# Altium schematic sheet vending_machine_V1.1.SchDoc
size A4; SheetNumber: 1; SheetTotal: 1
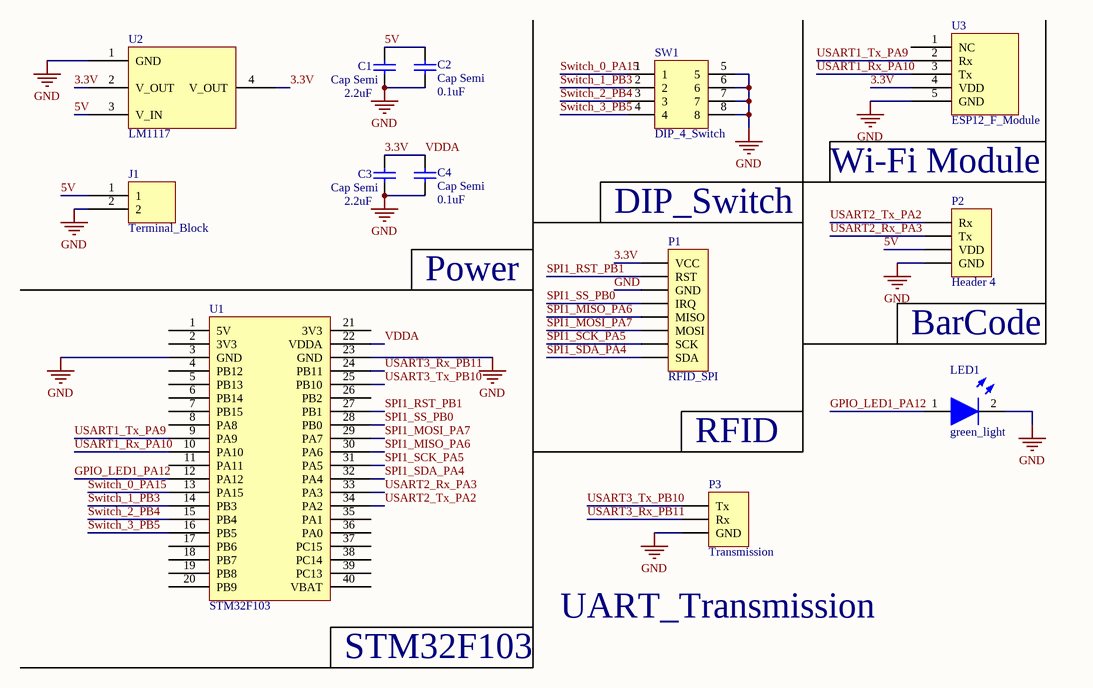
[diagram p0: vending_machine_V1.1.SchDoc]

## Parts
C1  Cap Semi  value 2.2uF  [1608[0603]]
C2  Cap Semi  value 0.1uF  [1608[0603]]
C3  Cap Semi  value 2.2uF  [1608[0603]]
C4  Cap Semi  value 0.1uF  [1608[0603]]
J1  Terminal_Block  [terminal block]
LED1  green_light  [LED_Green]
P1  RFID_SPI  [HDR1X8]
P2  Header 4  [HDR1X4]
P3  Transmission  [HDR1X3]
SW1  DIP_4_Switch  [Switch_4]
U1  STM32F103  [STM32F103]
U2  LM1117  [LM1117 - duplicate]
U3  ESP12_F_Module  [ESP12_F_Holtek]

## Nets
GND: C1.1 C2.1 C3.1 C4.1 J1.2 LED1.2 P1.3(GND) P2.4(GND) P3.3(GND) SW1.5 SW1.6 SW1.7 SW1.8 U1.3(GND) U1.23(GND) U2.1(GND) U3.5(GND)
3.3V: C3.2 C4.2 P1.1(VCC) U1.22(VDDA) U2.2(V_OUT) U2.4(V_OUT) U3.4(VDD)  [also labelled VDDA]
5V: C1.2 C2.2 J1.1 P2.3(VDD) U2.3(V_IN)
GPIO_LED1_PA12: LED1.1 U1.12(PA12)
SPI1_MISO_PA6: P1.5(MISO) U1.30(PA6)
SPI1_MOSI_PA7: P1.6(MOSI) U1.29(PA7)
SPI1_RST_PB1: P1.2(RST) U1.27(PB1)
SPI1_SCK_PA5: P1.7(SCK) U1.31(PA5)
SPI1_SDA_PA4: P1.8(SDA) U1.32(PA4)
SPI1_SS_PB0: P1.4(IRQ) U1.28(PB0)
Switch_0_PA15: SW1.1 U1.13(PA15)
Switch_1_PB3: SW1.2 U1.14(PB3)
Switch_2_PB4: SW1.3 U1.15(PB4)
Switch_3_PB5: SW1.4 U1.16(PB5)
USART1_Rx_PA10: U1.10(PA10) U3.3(Tx)
USART1_Tx_PA9: U1.9(PA9) U3.2(Rx)
USART2_Rx_PA3: P2.2(Tx) U1.33(PA3)
USART2_Tx_PA2: P2.1(Rx) U1.34(PA2)
USART3_Rx_PB11: P3.2(Rx) U1.24(PB11)
USART3_Tx_PB10: P3.1(Tx) U1.25(PB10)

Not connected (* = marked no-connect by the designer): U1 1(5V) 2(3V3) 4(PB12) 5(PB13) 6(PB14) 7(PB15) 8(PA8) 11(PA11) 17(PB6) 18(PB7) 19(PB8) 20(PB9) 21(3V3) 26(PB2) 35(PA1) 36(PA0) 37(PC15) 38(PC14) 39(PC13) 40(VBAT); U3 1(NC)

## Notes on the sheet
- (near P1) DIP_Switch
- Wi-Fi Module
- Power
- (near P2) BarCode
- RFID
- UART_Transmission
- (near U1) STM32F103

## Library data of the parts
C1-C4 = Cap Semi: Capacitor (Semiconductor SIM Model); Published: 8-Jun-2000; LatestRevisionDate: 29-May-2009; LatestRevisionNote: IPC-7351 Footprint Added.; PackageReference: C1206; Publisher: Altium Limited; PackageDescription: Chip Capacitor
J1 = Terminal Block
LED1 = LED_Green
P1 = Header 8: Header, 8-Pin; LatestRevisionDate: 17-Jul-2002; LatestRevisionNote: Re-released for DXP Platform.; Publisher: Altium Limited
P2 = Header 4: Header, 4-Pin; LatestRevisionDate: 17-Jul-2002; LatestRevisionNote: Re-released for DXP Platform.; Publisher: Altium Limited
P3 = Header 3: Header, 3-Pin; LatestRevisionDate: 17-Jul-2002; LatestRevisionNote: Re-released for DXP Platform.; Publisher: Altium Limited
SW1 = Switch_4
U3 = ESP12_F_Holtek